# EAGLE design Probe (EAGLE 9.6.2)

## Sheet 1 of 2
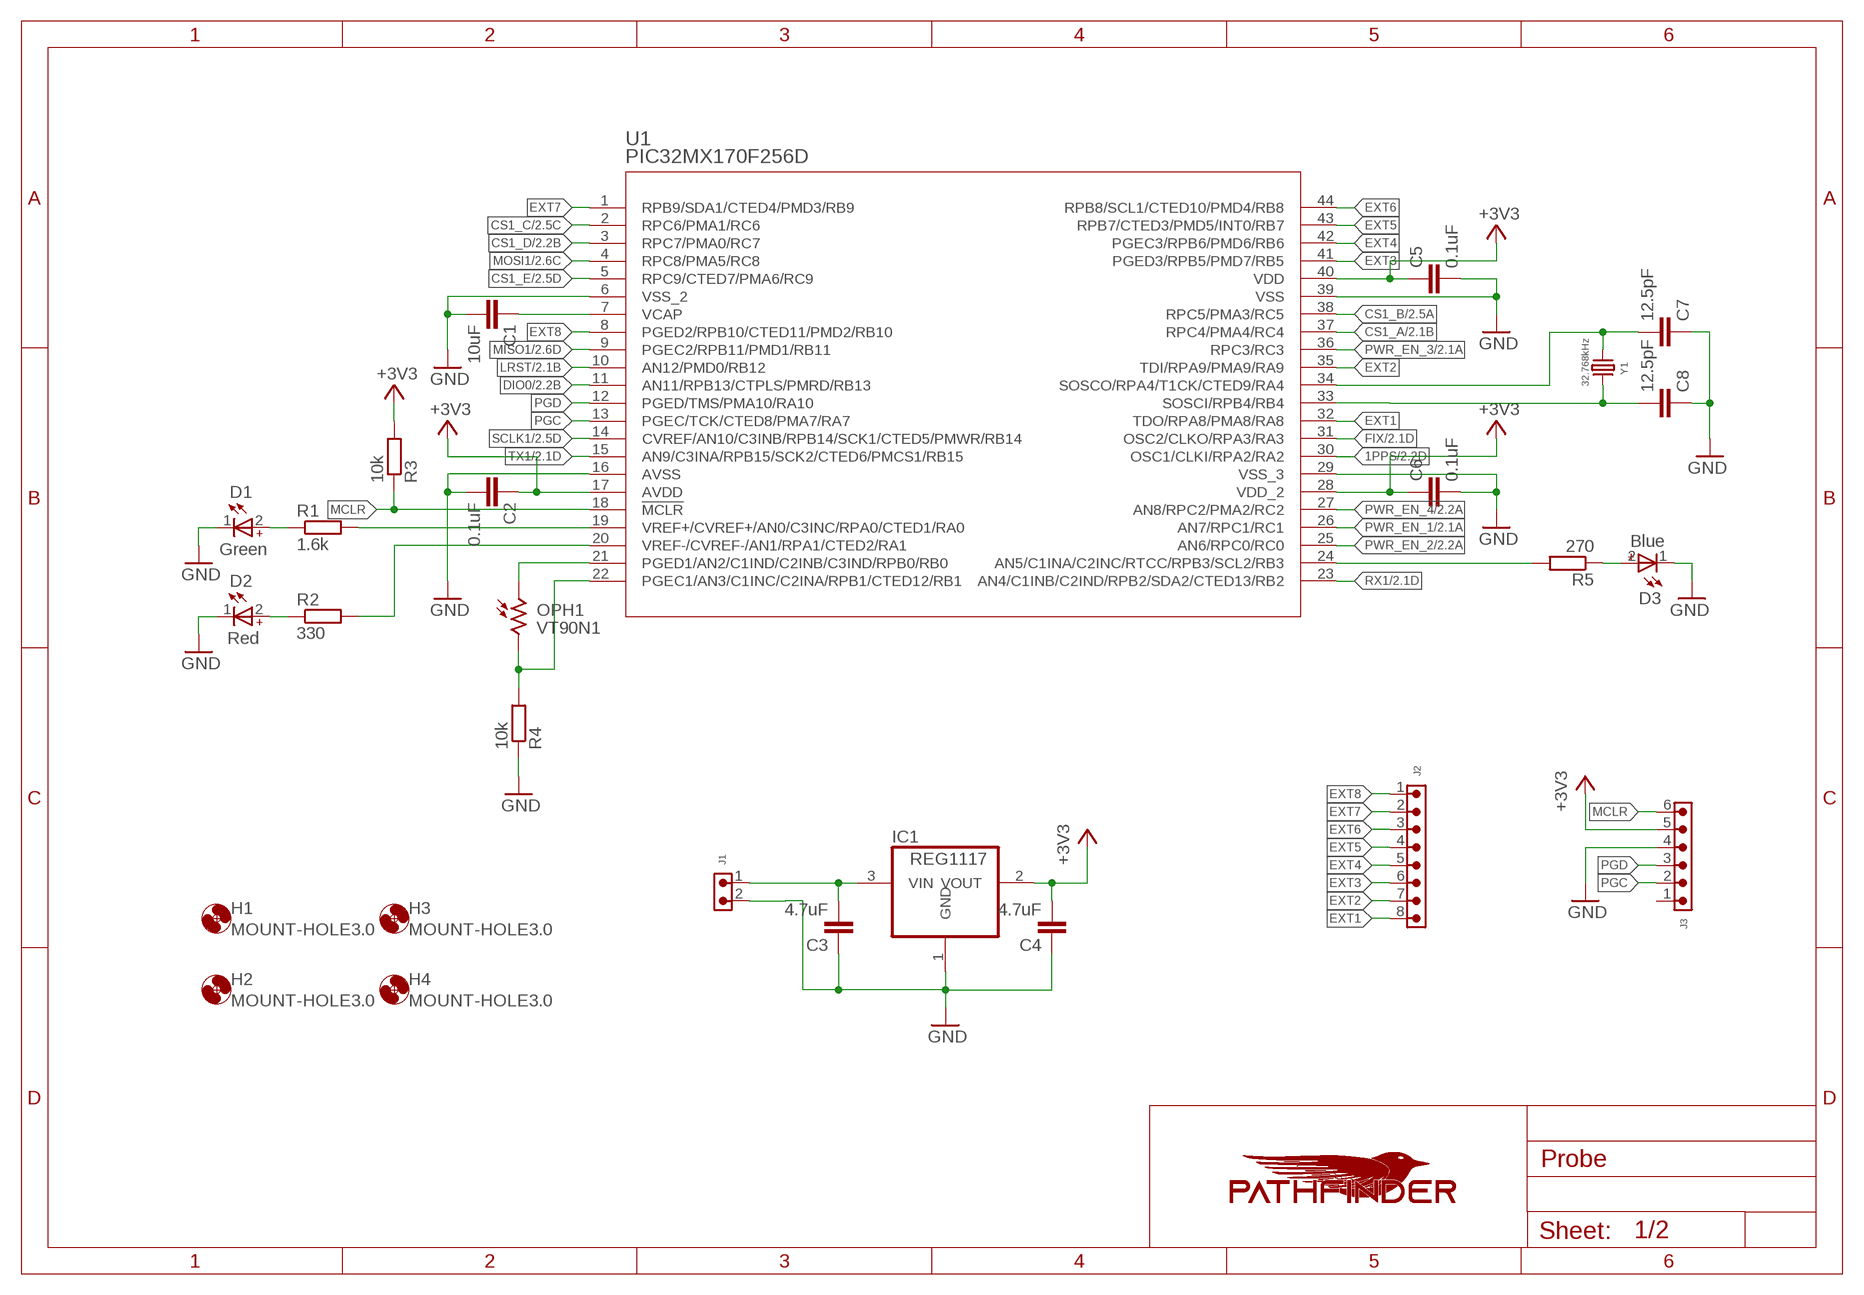
[diagram p0: schematic, sheet 1]

### Parts
C1  10uF  C-EUC0603  [C0603]
C2  0.1uF  C-EUC0402  [C0402]
C3  4.7uF  C-EUC0805  [C0805]
C4  4.7uF  C-EUC0805  [C0805]
C5  0.1uF  C-EUC0402  [C0402]
C6  0.1uF  C-EUC0402  [C0402]
C7  12.5pF  C-EUC0201  [C0201]
C8  12.5pF  C-EUC0201  [C0201]
D1  Green  WL-SMCD_0603_150060GS55040  [WL-SMCD_0603]
D2  Red  WL-SMCD_0603_150060RS55040  [WL-SMCD_0603]
D3  Blue  WL-SMCD_0603_150060BS55040  [WL-SMCD_0603]
H1  MOUNT-HOLE3.0  [3,0]
H2  MOUNT-HOLE3.0  [3,0]
H3  MOUNT-HOLE3.0  [3,0]
H4  MOUNT-HOLE3.0  [3,0]
IC1  REG1117  [SOT223]
J1  6130XX11021_61300211021  [61300211021]
J2  6130XX11021_61300811021  [61300811021]
J3  6130XX11021_61300611021  [61300611021]
OPH1  VT90N1  [VT900]
R1  1.6k  R-EU_R0402  [R0402]
R2  330  R-EU_R0402  [R0402]
R3  10k  R-EU_R0402  [R0402]
R4  10k  R-EU_R0402  [R0402]
R5  270  R-EU_R0402  [R0402]
U1  PIC32MX170F256D  PIC32MX150F128D-  [TQFP44_10X10MC]
U$1  PATHFINDER_LOGO24MM_6MIL_S  [PATHFINDER_LOGO_24MM_6MIL_SERIGRAPHY]
Y1  32.768kHz  WE-XTAL_CFPX-217_830009678  [WE-XTAL_CFPX-217]

### Nets
1PPS: U1.30(OSC1/CLKI/RPA2/RA2) ; also sheet 2
+3V3: C2.1 C4.2 C5.1 C6.1 IC1.2(VOUT) J3.5 R3.2 U1.17(AVDD) U1.28(VDD_2) U1.40(VDD) ; also sheet 2
CS1_A: U1.37(RPC4/PMA4/RC4) ; also sheet 2
CS1_B: U1.38(RPC5/PMA3/RC5) ; also sheet 2
CS1_C: U1.2(RPC6/PMA1/RC6) ; also sheet 2
CS1_D: U1.3(RPC7/PMA0/RC7) ; also sheet 2
CS1_E: U1.5(RPC9/CTED7/PMA6/RC9) ; also sheet 2
DIO0: U1.11(AN11/RPB13/CTPLS/PMRD/RB13) ; also sheet 2
EXT1: J2.8 U1.32(TDO/RPA8/PMA8/RA8)
EXT2: J2.7 U1.35(TDI/RPA9/PMA9/RA9)
EXT3: J2.6 U1.41(PGED3/RPB5/PMD7/RB5)
EXT4: J2.5 U1.42(PGEC3/RPB6/PMD6/RB6)
EXT5: J2.4 U1.43(RPB7/CTED3/PMD5/INT0/RB7)
EXT6: J2.3 U1.44(RPB8/SCL1/CTED10/PMD4/RB8)
EXT7: J2.2 U1.1(RPB9/SDA1/CTED4/PMD3/RB9)
EXT8: J2.1 U1.8(PGED2/RPB10/CTED11/PMD2/RB10)
FIX: U1.31(OSC2/CLKO/RPA3/RA3) ; also sheet 2
GND: C1.2 C2.2 C3.1 C4.1 C5.2 C6.2 C7.1 C8.1 D1.1(_) D2.1(_) D3.1(_) IC1.1(GND) J1.2 J3.4 R4.1 U1.6(VSS_2) U1.16(AVSS) U1.29(VSS_3) U1.39(VSS) ; also sheet 2
LRST: U1.10(AN12/PMD0/RB12) ; also sheet 2
MCLR: J3.6 R3.1 U1.18(!MCLR)
MISO1: U1.9(PGEC2/RPB11/PMD1/RB11) ; also sheet 2
MOSI1: U1.4(RPC8/PMA5/RC8) ; also sheet 2
N$1: C1.1 U1.7(VCAP)
N$5: C7.2 U1.34(SOSCO/RPA4/T1CK/CTED9/RA4) Y1.2
N$6: C8.2 U1.33(SOSCI/RPB4/RB4) Y1.1
N$7: D1.2(+) R1.1
N$8: D2.2(+) R2.1
N$10: OPH1.1 U1.21(PGED1/AN2/C1IND/C2INB/C3IND/RPB0/RB0)
N$11: R1.2 U1.19(VREF+/CVREF+/AN0/C3INC/RPA0/CTED1/RA0)
N$12: R2.2 U1.20(VREF-/CVREF-/AN1/RPA1/CTED2/RA1)
N$13: OPH1.2 R4.2 U1.22(PGEC1/AN3/C1INC/C2INA/RPB1/CTED12/RB1)
N$14: C3.2 IC1.3(VIN) J1.1
N$23: R5.2 U1.24(AN5/C1INA/C2INC/RTCC/RPB3/SCL2/RB3)
N$24: D3.2(+) R5.1
PGC: J3.2 U1.13(PGEC/TCK/CTED8/PMA7/RA7)
PGD: J3.3 U1.12(PGED/TMS/PMA10/RA10)
PWR_EN_1: U1.26(AN7/RPC1/RC1) ; also sheet 2
PWR_EN_2: U1.25(AN6/RPC0/RC0) ; also sheet 2
PWR_EN_3: U1.36(RPC3/RC3) ; also sheet 2
PWR_EN_4: U1.27(AN8/RPC2/PMA2/RC2) ; also sheet 2
RX1: U1.23(AN4/C1INB/C2IND/RPB2/SDA2/CTED13/RB2) ; also sheet 2
SCLK1: U1.14(CVREF/AN10/C3INB/RPB14/SCK1/CTED5/PMWR/RB14) ; also sheet 2
TX1: U1.15(AN9/C3INA/RPB15/SCK2/CTED6/PMCS1/RB15) ; also sheet 2
Unconnected: J3.1

## Sheet 2 of 2
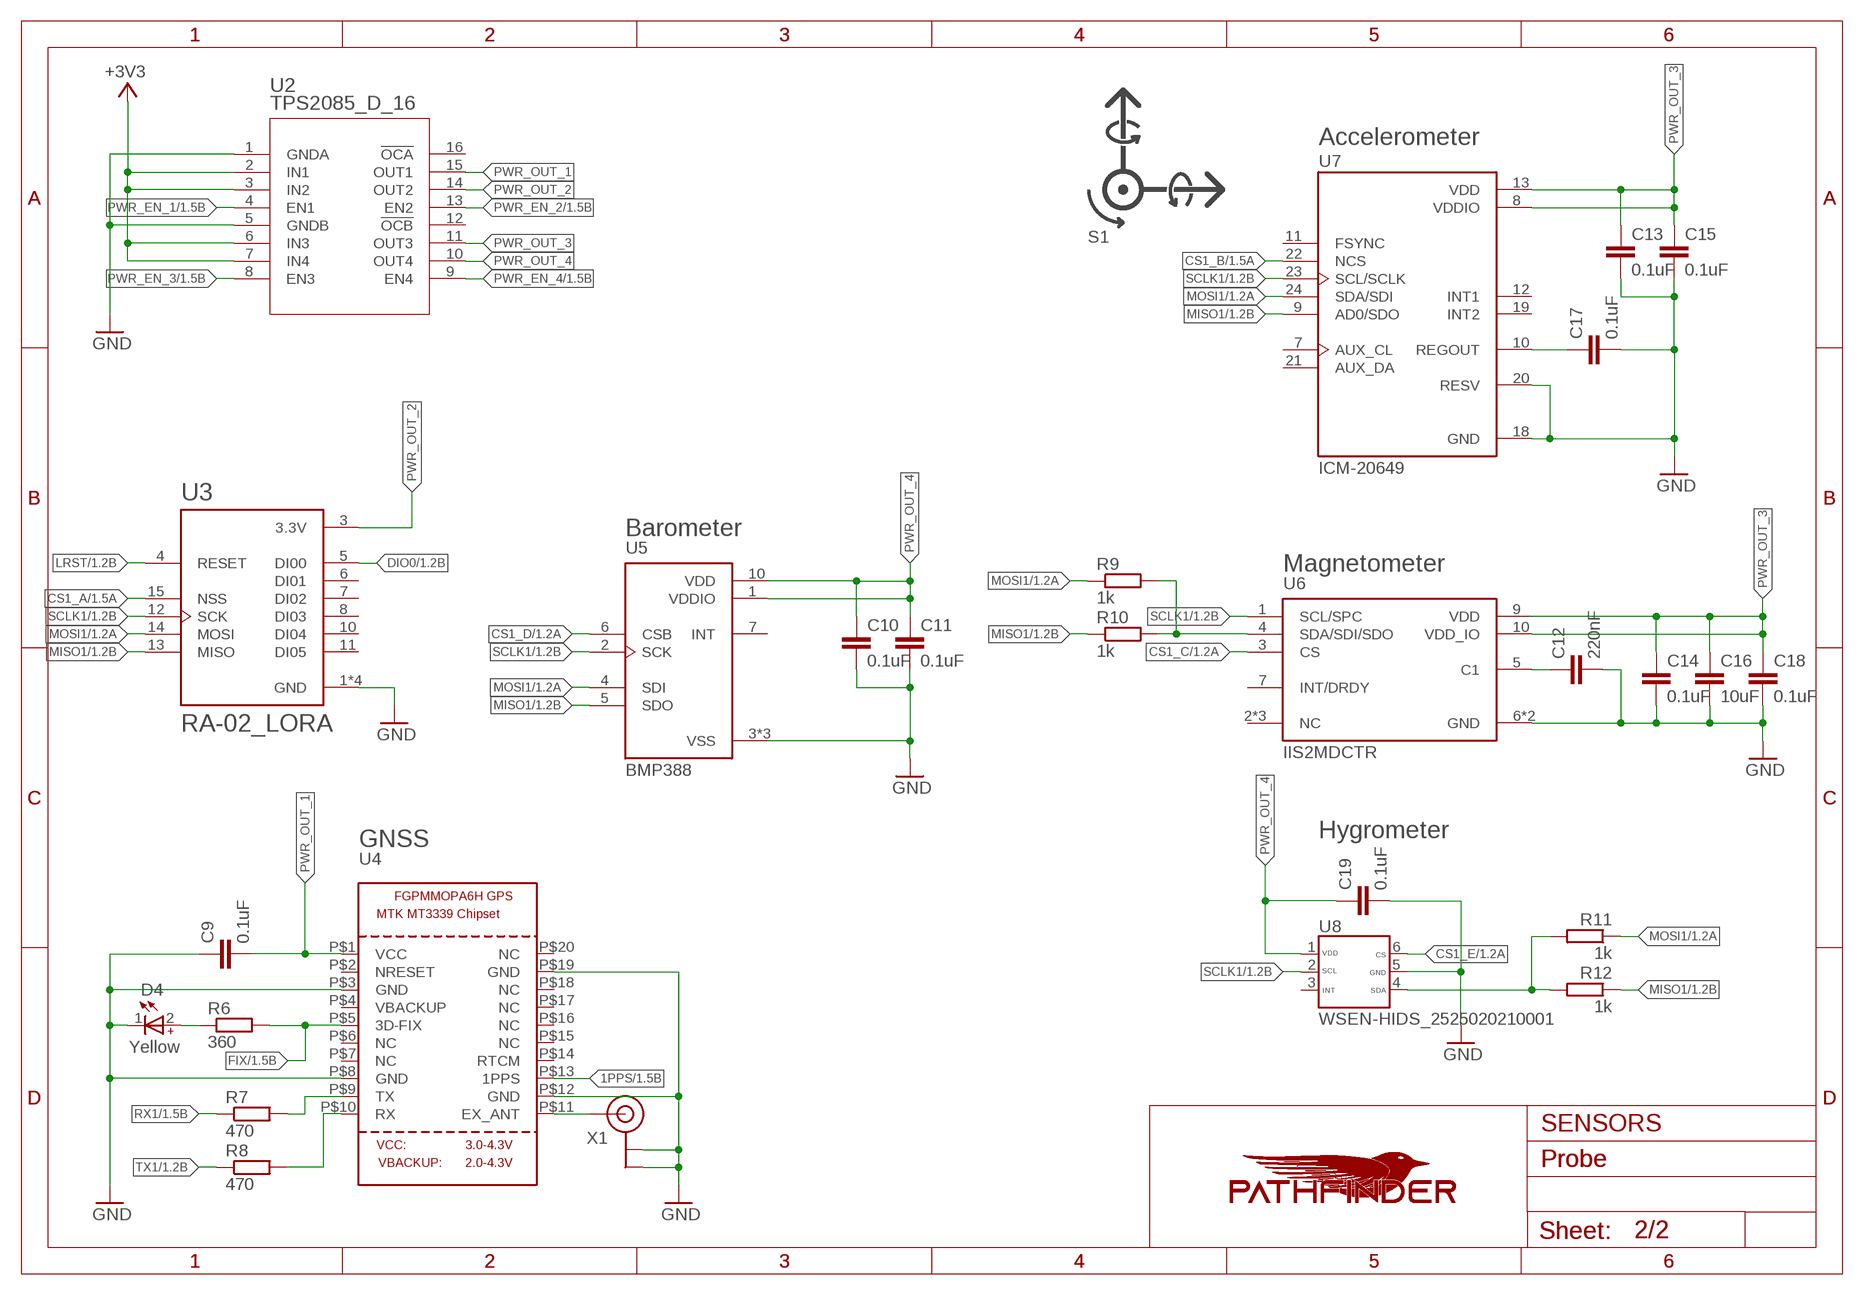
[diagram p1: schematic, sheet 2]

### Parts
C9  0.1uF  C-EUC0402  [C0402]
C10  0.1uF  C-EUC0402  [C0402]
C11  0.1uF  C-EUC0402  [C0402]
C12  220nF  C-EUC0402  [C0402]
C13  0.1uF  C-EUC0402  [C0402]
C14  0.1uF  C-EUC0402  [C0402]
C15  0.1uF  C-EUC0402  [C0402]
C16  10uF  C-EUC0603  [C0603]
C17  0.1uF  C-EUC0402  [C0402]
C18  0.1uF  C-EUC0402  [C0402]
C19  0.1uF  C-EUC0402  [C0402]
D4  Yellow  WL-SMCD_0603_150060YS55040  [WL-SMCD_0603]
R6  360  R-EU_R0402  [R0402]
R7  470  R-EU_R0402  [R0402]
R8  470  R-EU_R0402  [R0402]
R9  1k  R-EU_R0402  [R0402]
R10  1k  R-EU_R0402  [R0402]
R11  1k  R-EU_R0402  [R0402]
R12  1k  R-EU_R0402  [R0402]
S1  COORDINATE_SYSTEM  [DIRECT_AXES]
U2  TPS2085_D_16  [D16]
U3  RA-02_LORA  [MODULE_RA-02_LORA]
U4  GPS_FGPMMOPA6H  [FGPMMOPA6H]
U5  BMP388  [PQFN50P200X200X80-10N]
U6  IIS2MDCTR  [LGA12R50P4X4_200X200X70]
U7  ICM-20649  [QFN40P300X300X95-24N]
U8  WSEN-HIDS_2525020210001  WSEN-HIDS_2525020210001_SIMPLE  [WSEN-HIDS_2525020210001_SIMPLE]
U$2  PATHFINDER_LOGO24MM_6MIL_S  [PATHFINDER_LOGO_24MM_6MIL_SERIGRAPHY]
X1  ANTENNA_U.FL  [U.FL]

### Nets
1PPS: U4.P$13(1PPS) ; also sheet 1
+3V3: U2.2(IN1) U2.3(IN2) U2.6(IN3) U2.7(IN4) ; also sheet 1
CS1_A: U3.15(NSS) ; also sheet 1
CS1_B: U7.22(NCS) ; also sheet 1
CS1_C: U6.3(CS) ; also sheet 1
CS1_D: U5.6(CSB) ; also sheet 1
CS1_E: U8.6(CS) ; also sheet 1
DIO0: U3.5(DI00) ; also sheet 1
FIX: R6.2 U4.P$5(3D-FIX) ; also sheet 1
GND: C9.1 C10.2 C11.2 C12.2 C13.2 C14.2 C15.2 C16.2 C17.2 C18.2 C19.2 D4.1(_) U2.1(GNDA) U2.5(GNDB) U3.1(GND) U3.2(GND) U3.9(GND) U3.16(GND) U4.P$3(GND) U4.P$8(GND) U4.P$12(GND) U4.P$19(GND) U5.3(VSS) U5.8(VSS) U5.9(VSS) U6.6(GND) U6.8(GND) U7.18(GND) U7.20(RESV) U8.5(GND) X1.1(GND) X1.2(GND) ; also sheet 1
LRST: U3.4(RESET) ; also sheet 1
MISO1: R10.1 R12.1 U3.13(MISO) U5.5(SDO) U7.9(AD0/SDO) ; also sheet 1
MOSI1: R9.1 R11.1 U3.14(MOSI) U5.4(SDI) U7.24(SDA/SDI) ; also sheet 1
N$2: C17.1 U7.10(REGOUT)
N$4: D4.2(+) R6.1
N$25: U4.P$11(EX_ANT) X1.3(SIGNAL)
N$29: R7.2 U4.P$9(TX)
N$35: R8.2 U4.P$10(RX)
N$38: R9.2 R10.2 U6.4(SDA/SDI/SDO)
N$39: C12.1 U6.5(C1)
N$43: R11.2 R12.2 U8.4(SDA)
PWR_EN_1: U2.4(EN1) ; also sheet 1
PWR_EN_2: U2.13(EN2) ; also sheet 1
PWR_EN_3: U2.8(EN3) ; also sheet 1
PWR_EN_4: U2.9(EN4) ; also sheet 1
PWR_OUT_1: C9.2 U2.15(OUT1) U4.P$1(VCC)
PWR_OUT_2: U2.14(OUT2) U3.3(3.3V)
PWR_OUT_3: C13.1 C14.1 C15.1 C16.1 C18.1 U2.11(OUT3) U6.9(VDD) U6.10(VDD_IO) U7.8(VDDIO) U7.13(VDD)
PWR_OUT_4: C10.1 C11.1 C19.1 U2.10(OUT4) U5.1(VDDIO) U5.10(VDD) U8.1(VDD)
RX1: R7.1 ; also sheet 1
SCLK1: U3.12(SCK) U5.2(SCK) U6.1(SCL/SPC) U7.23(SCL/SCLK) U8.2(SCL) ; also sheet 1
TX1: R8.1 ; also sheet 1
Unconnected: U2.12(!OCB) U2.16(!OCA) U3.6(DI01) U3.7(DI02) U3.8(DI03) U3.10(DI04) U3.11(DI05) U4.P$2(NRESET) U4.P$4(VBACKUP) U4.P$6(NC) U4.P$7(NC) U4.P$14(RTCM) U4.P$15(NC) U4.P$16(NC) U4.P$17(NC) U4.P$18(NC) U4.P$20(NC) U5.7(INT) U6.2(NC) U6.7(INT/DRDY) U6.11(NC) U6.12(NC) U7.7(AUX_CL) U7.11(FSYNC) U7.12(INT1) U7.19(INT2) U7.21(AUX_DA) U8.3(INT)

### Notes on the sheet
- Accelerometer
- Barometer
- Magnetometer
- Hygrometer
- GNSS
- SENSORS

## Library data of the parts
C1-C19 = rcl:C-EU: CAPACITOR, European symbol; SPICEPREFIX: C
D1 = Wurth_LEDs_WL-SMCD:WL-SMCD_0603: WL-SMCD SMT Mono-color Chip LED Diffused Characteristics Industrial 0603 platform – 1.6 x 0.8 mm Wide viewing angle 140° Thin version: 0.4 mm Applications Office Automation Home appliances Industrial equipment Front panel backlighting Button backlighting LCD backlighting Navigation backlighting <https://www.we-online.com/catalog/media/o121399v209%20Family_WL-SMCD_0603_thin_0,4mm_150060xx55040.jpg> Details see: https://www.we-online.com/catalog/en/WL-SMCD/ Updated By Yingchun Shan 2020-03-18 2020 (C) Wurth Elektronik; ABSTRAHLWINKEL: 140°; CHIP-TECHNOLOGY: InGaN; DATASHEET-URL: https://www.we-online.com/catalog/datasheet/150060GS55040.pdf; EMITTING-COLOR: Green; I-V-TYP: 430mcd; LAMDA-DOM-TYP: 525nm; LAMDA-PEAK-TYP: 520nm; PART-NUMBER: 150060GS55040; V-F-TYP: 3.2V
D2 = Wurth_LEDs_WL-SMCD:WL-SMCD_0603: WL-SMCD SMT Mono-color Chip LED Diffused Characteristics Industrial 0603 platform – 1.6 x 0.8 mm Wide viewing angle 140° Thin version: 0.4 mm Applications Office Automation Home appliances Industrial equipment Front panel backlighting Button backlighting LCD backlighting Navigation backlighting <https://www.we-online.com/catalog/media/o121399v209%20Family_WL-SMCD_0603_thin_0,4mm_150060xx55040.jpg> Details see: https://www.we-online.com/catalog/en/WL-SMCD/ Updated By Yingchun Shan 2020-03-18 2020 (C) Wurth Elektronik; ABSTRAHLWINKEL: 140°; CHIP-TECHNOLOGY: AlInGaP; DATASHEET-URL: https://www.we-online.com/catalog/datasheet/150060RS55040.pdf; EMITTING-COLOR: Red; I-V-TYP: 90mcd; LAMDA-DOM-TYP: 624nm; LAMDA-PEAK-TYP: 632nm; PART-NUMBER: 150060RS55040; V-F-TYP: 2V
D3 = Wurth_LEDs_WL-SMCD:WL-SMCD_0603: WL-SMCD SMT Mono-color Chip LED Diffused Characteristics Industrial 0603 platform – 1.6 x 0.8 mm Wide viewing angle 140° Thin version: 0.4 mm Applications Office Automation Home appliances Industrial equipment Front panel backlighting Button backlighting LCD backlighting Navigation backlighting <https://www.we-online.com/catalog/media/o121399v209%20Family_WL-SMCD_0603_thin_0,4mm_150060xx55040.jpg> Details see: https://www.we-online.com/catalog/en/WL-SMCD/ Updated By Yingchun Shan 2020-03-18 2020 (C) Wurth Elektronik; ABSTRAHLWINKEL: 140°; CHIP-TECHNOLOGY: InGaN; DATASHEET-URL: https://www.we-online.com/catalog/datasheet/150060BS55040.pdf; EMITTING-COLOR: Blue; I-V-TYP: 80mcd; LAMDA-DOM-TYP: 470nm; LAMDA-PEAK-TYP: 465nm; PART-NUMBER: 150060BS55040; V-F-TYP: 3.2V
D4 = Wurth_LEDs_WL-SMCD:WL-SMCD_0603: WL-SMCD SMT Mono-color Chip LED Diffused Characteristics Industrial 0603 platform – 1.6 x 0.8 mm Wide viewing angle 140° Thin version: 0.4 mm Applications Office Automation Home appliances Industrial equipment Front panel backlighting Button backlighting LCD backlighting Navigation backlighting <https://www.we-online.com/catalog/media/o121399v209%20Family_WL-SMCD_0603_thin_0,4mm_150060xx55040.jpg> Details see: https://www.we-online.com/catalog/en/WL-SMCD/ Updated By Yingchun Shan 2020-03-18 2020 (C) Wurth Elektronik; ABSTRAHLWINKEL: 140°; CHIP-TECHNOLOGY: AlInGaP; DATASHEET-URL: https://www.we-online.com/catalog/datasheet/150060YS55040.pdf; EMITTING-COLOR: Yellow; I-V-TYP: 100mcd; LAMDA-DOM-TYP: 589nm; LAMDA-PEAK-TYP: 591nm; PART-NUMBER: 150060YS55040; V-F-TYP: 2V
H1-H4 = holes:MOUNT-HOLE: MOUNTING HOLE with drill center marker
IC1 = burr-brown:REG1117: 800mA and 1A Low Dropout (LDO) Positive Regulator 1.8V, 2.5V, 2.85V, 3.3V, 5V, and Adj; MPN: REG1117; OC_FARNELL: 1097566; OC_NEWARK: 14P6981
J1 = Wurth_Connectors_WR-PHD:6130XX11021_61300211021: WR-PHD 2.54 mm THT Angled Pin Header ARTICLE PROPERTIES: Pins:2;​ 3;​ 4;​ 5;​ 6;​ 7;​ 8;​ 9;​ 10;​ 12;​ 14;​ 16;​ 18;​ 22;​ 32;​ 34;​ 36;​ 40 KIND PROPERTIES: Pitch：2.54 mm Quality Class:3 as per CECC 75 301-802 Rows：Single Gender：Pin Header Type：Angled MATERIAL PROPERTIES: Insulator Material :PA6T Insulator Flammability Rating:UL94 V-0 Contact Material:Copper Alloy Contact Plating:Gold Contact Type:Stamped GENERAL INFORMATION Operating Temperature:-40 up to +105 °C Compliance:Lead free / RoHS ELECTRICAL PROPERTIES: Rated Current:3 A IR 1:3 A Withstanding Voltage:500 V (AC) Contact Resistance:20 mΩ RISO:1000 MΩ CERTIFICATION UL Approval:E323964 PACKAGING PROPERTIES Packaging:Bag <https://katalog.we-online.com/media/images/v2/o33210v209%20Family_WR-PHD_6130xx11021.jpg> Details see: https://katalog.we-online.com/en/em/PHD_2_54_THT_ANGLED_PIN_HEADER_6130XX11021 Updated by Yingchun,Shan 2019-10-16 2019 (C) Würth Elektronik; DATASHEET-URL: https://katalog.we-online.com/em/datasheet/61300211021.pdf; GENDER: Pin Header; IR: 3A; MATES: WR-PHD 2.5mm Angled Socket Header/SMT Socket Header/Socket Header/Soket Header Bottom Entry; PACKAGING: Bag; PART-NUMBER: 61300211021; PINS: 2; ROWS: Single; TYPE: Angled
J2 = Wurth_Connectors_WR-PHD:6130XX11021_61300811021: WR-PHD 2.54 mm THT Angled Pin Header ARTICLE PROPERTIES: Pins:2;​ 3;​ 4;​ 5;​ 6;​ 7;​ 8;​ 9;​ 10;​ 12;​ 14;​ 16;​ 18;​ 22;​ 32;​ 34;​ 36;​ 40 KIND PROPERTIES: Pitch：2.54 mm Quality Class:3 as per CECC 75 301-802 Rows：Single Gender：Pin Header Type：Angled MATERIAL PROPERTIES: Insulator Material :PA6T Insulator Flammability Rating:UL94 V-0 Contact Material:Copper Alloy Contact Plating:Gold Contact Type:Stamped GENERAL INFORMATION Operating Temperature:-40 up to +105 °C Compliance:Lead free / RoHS ELECTRICAL PROPERTIES: Rated Current:3 A IR 1:3 A Withstanding Voltage:500 V (AC) Contact Resistance:20 mΩ RISO:1000 MΩ CERTIFICATION UL Approval:E323964 PACKAGING PROPERTIES Packaging:Bag <https://katalog.we-online.com/media/images/v2/o33210v209%20Family_WR-PHD_6130xx11021.jpg> Details see: https://katalog.we-online.com/en/em/PHD_2_54_THT_ANGLED_PIN_HEADER_6130XX11021 Updated by Yingchun,Shan 2019-10-16 2019 (C) Würth Elektronik; DATASHEET-URL: https://katalog.we-online.com/em/datasheet/61300811021.pdf; GENDER: Pin Header; IR: 3A; MATES: WR-PHD 2.5mm Angled Socket Header/SMT Socket Header/Socket Header/Soket Header Bottom Entry; PACKAGING: Bag; PART-NUMBER: 61300811021; PINS: 8; ROWS: Single; TYPE: Angled
J3 = Wurth_Connectors_WR-PHD:6130XX11021_61300611021: WR-PHD 2.54 mm THT Angled Pin Header ARTICLE PROPERTIES: Pins:2;​ 3;​ 4;​ 5;​ 6;​ 7;​ 8;​ 9;​ 10;​ 12;​ 14;​ 16;​ 18;​ 22;​ 32;​ 34;​ 36;​ 40 KIND PROPERTIES: Pitch：2.54 mm Quality Class:3 as per CECC 75 301-802 Rows：Single Gender：Pin Header Type：Angled MATERIAL PROPERTIES: Insulator Material :PA6T Insulator Flammability Rating:UL94 V-0 Contact Material:Copper Alloy Contact Plating:Gold Contact Type:Stamped GENERAL INFORMATION Operating Temperature:-40 up to +105 °C Compliance:Lead free / RoHS ELECTRICAL PROPERTIES: Rated Current:3 A IR 1:3 A Withstanding Voltage:500 V (AC) Contact Resistance:20 mΩ RISO:1000 MΩ CERTIFICATION UL Approval:E323964 PACKAGING PROPERTIES Packaging:Bag <https://katalog.we-online.com/media/images/v2/o33210v209%20Family_WR-PHD_6130xx11021.jpg> Details see: https://katalog.we-online.com/en/em/PHD_2_54_THT_ANGLED_PIN_HEADER_6130XX11021 Updated by Yingchun,Shan 2019-10-16 2019 (C) Würth Elektronik; DATASHEET-URL: https://katalog.we-online.com/em/datasheet/61300611021.pdf; GENDER: Pin Header; IR: 3A; MATES: WR-PHD 2.5mm Angled Socket Header/SMT Socket Header/Socket Header/Soket Header Bottom Entry; PACKAGING: Bag; PART-NUMBER: 61300611021; PINS: 6; ROWS: Single; TYPE: Angled
OPH1 = photo-elements:VT9: Photoconductive Cell VT900 Series Source: http://optoelectronics.perkinelmer.com/content/Datasheets/DTS_vt900seriesdatasheet.pdf
R1-R12 = rcl:R-EU_: RESISTOR, European symbol; SPICEPREFIX: R
S1 = axes:COORDINATE_SYSTEM
U1 = Microchip:PIC32MX150F128D-
U2 = Texas-Instruments:TPS2085_D_16; MANUFACTURER_PART_NUMBER: tps2085_d_16; VENDOR: Texas Instruments
U3 = RA-02_LORA:RA-02_LORA: Ra-02 LoRa RF M5Stack Platform Evaluation Expansion Board; AVAILABILITY: Unavailable; DESCRIPTION: Ra-02 LoRa RF M5Stack Platform Evaluation Expansion Board; MF: AI-Thinker; MP: Ra-02 LoRa; PACKAGE: Package; PRICE: None
U4 = adafruit:GPS_FGPMMOPA6H: GPS Module - MTK MT3339 Chipset, -165dBm sensitivity, 22 channels, 10Hz, auto-select external antenna options
U5 = Bosh-Sensortec:BMP388: P-Sensor SPI I2C 1, 25 Bar SMD; AVAILABILITY: Unavailable; DESCRIPTION: Pressure Sensor 4.35PSI ~ 18.13PSI (30kPa ~ 125kPa) Absolute 10-WFLGA; MF: Bosch Sensortec; MP: BMP388; PACKAGE: WFLGA-10 Bosch Tools; PRICE: None
U6 = ST-Microelectronics:IIS2MDCTR; MANUFACTURER: ST; PART_NUMBER: IIS2MDCTR
U7 = TDK-Ivensense:ICM-20649: Wide-Range 6-Axis MEMS MotionTracking Device for Sports and High Impact Applications Check prices <https://pricing.snapeda.com/parts/ICM-20649/TDK%20InvenSense/view-part?ref=eda>; AVAILABILITY: Warning; DESCRIPTION: Accelerometer, Gyroscope, Temperature, 6 Axis Sensor I²C, SPI Output; MF: TDK InvenSense; MP: ICM-20649; PACKAGE: QFN-24 TDK; PRICE: None; PURCHASE-URL: https://pricing.snapeda.com/search/part/ICM-20649/?ref=eda
U8 = WE_WSEN-Rev4.1:WSEN-HIDS_2525020210001_SIMPLE: WSEN-HIDS - 2525020210001 Humidity Sensor with integrated Temperature Sensor Details see: https://www.we-online.de/katalog/en/WSEN-HIDS; HEIGHT: 0.9mm; MANUFACTURER: Würth Elektronik; NR: 2525020210001
U$1 U$2 = pathfinder-logo:PATHFINDER_LOGO
X1 = adafruit:ANTENNA_U.FL: U.FL Antenna Connector
Y1 = Eagle_WE-XTAL (rev20b):WE-XTAL_CFPX-217: WE-XTAL Watch Crystals Characteristics SMT and THT models Hermetically sealed Frequency: 32.768 kHz Tolerances down to ±10 ppm available Characteristics Microprocessor Real Time Clocks Test and Measurement Equipment Battery powered Applications <https://www.we-online.com/catalog/media/o162740v209%20Family_WE-XTAL_WatchCrystal.jpg> Details see: https://www.we-online.com/catalog/en/WE-XTAL_WATCHCRYSTAL Updated by Ella Wu, 2020-10-30 2020 (C) Wurth Elektronik; C-LOAD: 12.5pF; DATASHEET-URL: https://www.we-online.com/catalog/datasheet/830009678.pdf; MOUNT: SMT; PART-NUMBER: 830009678; TOLERANCE: ±20ppm

## Board
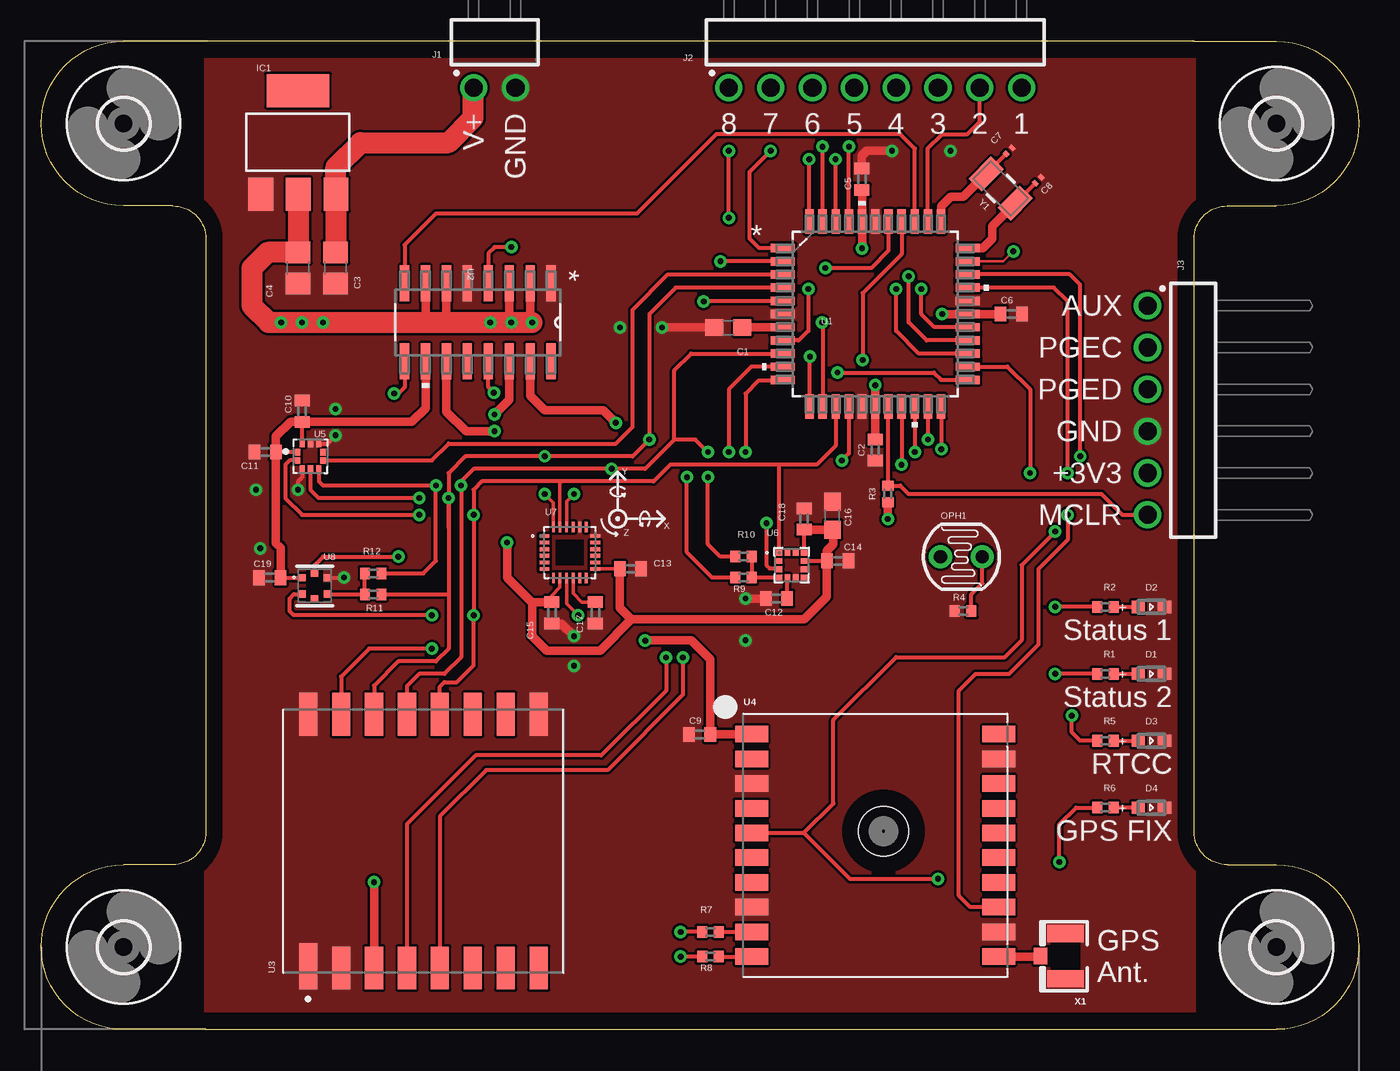
[diagram p2: board, top side]
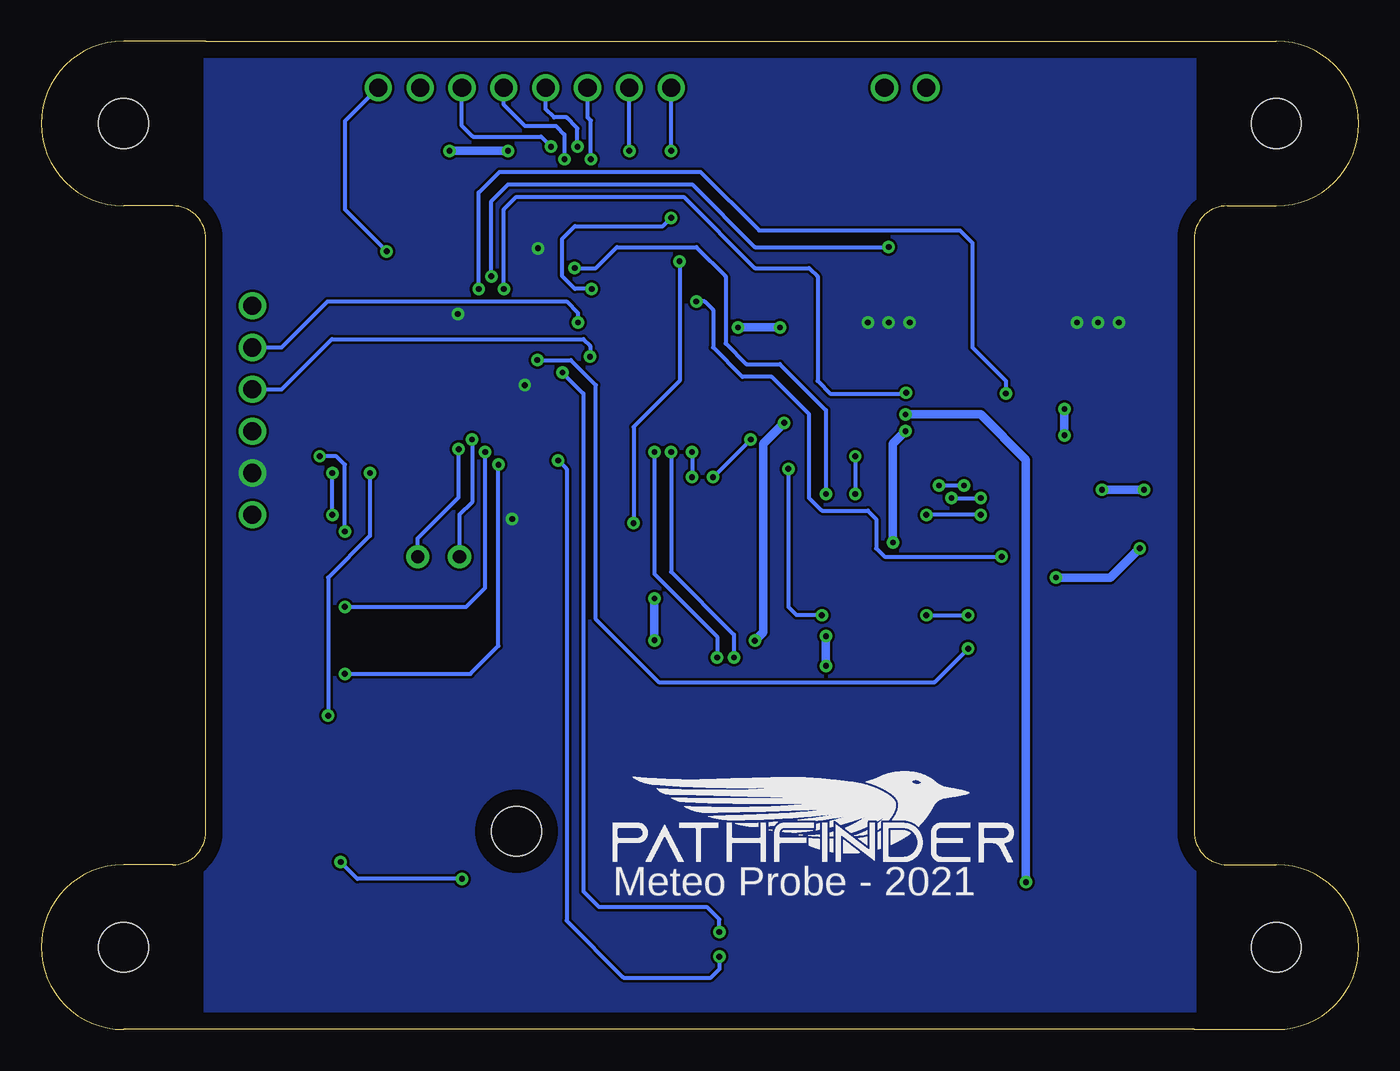
[diagram p3: board, bottom side, seen from below]

Size 80 x 60 mm. Coordinates in mm from the lower left corner, seen from the top.
Outline: 10,0 70,0 75,0 arc180 75,10 72,10 arc-90 70,12 70,48 arc-90 72,50 75,50 arc180 75,60 70,60 10,60 5,60 arc180 5,50 8,50 arc-90 10,48 10,12 arc-90 8,10 5,10 arc180 5,0 10,0
Copper layers (1*16): Top 0.035mm / dielectric 0.2mm / Bottom 0.035mm
Design rules "FirstPCB *": minimum track width 6mil, minimum drill 0.35mm, track to track 6mil, track to pad 6mil, pad to pad 6mil, via to via 6mil, smd to smd 6mil, copper to edge 40mil, drill to drill 6mil, minimum pad ring 10mil, minimum via ring 8mil, stop-mask expansion 2mil, vias tented up to drill 100mil, thermal gap 10mil

### Footprints (pad centres in the part's own frame; a part is rotated, then mirrored left to right if it is on the bottom)
C0603 = smd 1.1 x 1: 1 -0.85,0; 2 0.85,0
C0402 = smd 0.7 x 0.9: 1 -0.65,0; 2 0.65,0
C0805 = smd 1.3 x 1.5: 1 -0.95,0; 2 0.95,0
C0201 = smd 0.25 x 0.35: 1 -0.25,0; 2 0.25,0
WL-SMCD_0603 = smd 0.8 x 0.75: 1 -0.8,0; 2 0.8,0
3,0 = hole 3: 0,0
SOT223 = smd 1.499 x 2.007: 1 -2.261,-3.15; 2 0.025,-3.15; 3 2.311,-3.15 | smd 3.81 x 2.007: 4 0,3.15
61300211021 = drill 1.1: 1 1.27,2.77; 2 -1.27,2.77
61300811021 = drill 1.1: 1 8.89,2.77; 2 6.35,2.77; 3 3.81,2.77; 4 1.27,2.77; 5 -1.27,2.77; 6 -3.81,2.77; 7 -6.35,2.77; 8 -8.89,2.77
61300611021 = drill 1.1: 1 6.35,2.77; 2 3.81,2.77; 3 1.27,2.77; 4 -1.27,2.77; 5 -3.81,2.77; 6 -6.35,2.77
VT900 = drill 0.8 pad 1.4: 1 -1.27,0; 2 1.27,0
R0402 = smd 0.6 x 0.7: 1 -0.5,0; 2 0.5,0
TQFP44_10X10MC = smd 1.473 x 0.508: 1 -5.613,4; 2 -5.613,3.2; 3 -5.613,2.4; 4 -5.613,1.6; 5 -5.613,0.8; 6 -5.613,0; 7 -5.613,-0.8; 8 -5.613,-1.6; 9 -5.613,-2.4; 10 -5.613,-3.2; 11 -5.613,-4; 23 5.613,-4; 24 5.613,-3.2; 25 5.613,-2.4; 26 5.613,-1.6; 27 5.613,-0.8; 28 5.613,0; 29 5.613,0.8; 30 5.613,1.6; 31 5.613,2.4; 32 5.613,3.2; 33 5.613,4 | smd 0.508 x 1.473: 12 -4,-5.613; 13 -3.2,-5.613; 14 -2.4,-5.613; 15 -1.6,-5.613; 16 -0.8,-5.613; 17 0,-5.613; 18 0.8,-5.613; 19 1.6,-5.613; 20 2.4,-5.613; 21 3.2,-5.613; 22 4,-5.613; 34 4,5.613; 35 3.2,5.613; 36 2.4,5.613; 37 1.6,5.613; 38 0.8,5.613; 39 0,5.613; 40 -0.8,5.613; 41 -1.6,5.613; 42 -2.4,5.613; 43 -3.2,5.613; 44 -4,5.613
D16 = smd 2.184 x 0.559: 1 -2.362,4.445; 2 -2.362,3.175; 3 -2.362,1.905; 4 -2.362,0.635; 5 -2.362,-0.635; 6 -2.362,-1.905; 7 -2.362,-3.175; 8 -2.362,-4.445; 9 2.362,-4.445; 10 2.362,-3.175; 11 2.362,-1.905; 12 2.362,-0.635; 13 2.362,0.635; 14 2.362,1.905; 15 2.362,3.175; 16 2.362,4.445
MODULE_RA-02_LORA = smd 2.8 x 1.1: 1 -7.6,7 | smd 2.6 x 1.1: 2 -7.7,5; 3 -7.7,3; 4 -7.7,1; 5 -7.7,-1; 6 -7.7,-3; 7 -7.7,-5; 8 -7.7,-7; 9 7.7,-7; 10 7.7,-5; 11 7.7,-3; 12 7.7,-1; 13 7.7,1; 14 7.7,3; 15 7.7,5; 16 7.7,7
FGPMMOPA6H = smd 2 x 1: P$1 -7.5,6.75; P$2 -7.5,5.25; P$3 -7.5,3.75; P$4 -7.5,2.25; P$5 -7.5,0.75; P$6 -7.5,-0.75; P$7 -7.5,-2.25; P$8 -7.5,-3.75; P$9 -7.5,-5.25; P$10 -7.5,-6.75; P$11 7.5,-6.75; P$12 7.5,-5.25; P$13 7.5,-3.75; P$14 7.5,-2.25; P$15 7.5,-0.75; P$16 7.5,0.75; P$17 7.5,2.25; P$18 7.5,3.75; P$19 7.5,5.25; P$20 7.5,6.75 | hole 3: 0.5,0.85
PQFN50P200X200X80-10N = smd 0.35 x 0.38: 1 -0.765,0.25; 2 -0.765,-0.25; 3 -0.5,-0.765; 4 0,-0.765; 5 0.5,-0.765; 6 0.765,-0.25; 7 0.765,0.25; 8 0.5,0.765; 9 0,0.765; 10 -0.5,0.765
LGA12R50P4X4_200X200X70 = smd 0.4 x 0.35: 1 -0.76,0.75; 2 -0.76,0.25; 3 -0.76,-0.25; 4 -0.76,-0.75; 7 0.76,-0.75; 8 0.76,-0.25; 9 0.76,0.25; 10 0.76,0.75 | smd 0.35 x 0.4: 5 -0.25,-0.76; 6 0.25,-0.76; 11 0.25,0.76; 12 -0.25,0.76
QFN40P300X300X95-24N = smd 0.64 x 0.22: 1 -1.545,1; 2 -1.545,0.6; 3 -1.545,0.2; 4 -1.545,-0.2; 5 -1.545,-0.6; 6 -1.545,-1; 13 1.545,-1; 14 1.545,-0.6; 15 1.545,-0.2; 16 1.545,0.2; 17 1.545,0.6; 18 1.545,1 | smd 0.22 x 0.64: 7 -1,-1.545; 8 -0.6,-1.545; 9 -0.2,-1.545; 10 0.2,-1.545; 11 0.6,-1.545; 12 1,-1.545; 19 1,1.545; 20 0.6,1.545; 21 0.2,1.545; 22 -0.2,1.545; 23 -0.6,1.545; 24 -1,1.545
WSEN-HIDS_2525020210001_SIMPLE = smd 0.4 x 0.45: 1 -0.75,0.5; 2 -0.75,-0.5; 4 0.75,-0.5; 5 0.75,0.5 | smd 0.45 x 0.4: 3 0,-0.75; 6 0,0.75
U.FL = smd 2.2 x 1.05: 1 0,1.375; 2 0,-1.375 | smd 0.8 x 1: 3 1.525,0
WE-XTAL_CFPX-217 = smd 1.1 x 1.9: 1 -1.25,0; 2 1.25,0

### Placement (x,y rotation side)
C1  41.72,42.62 180 top
C2  50.64,35.18 270 top
C3  17.87,46.23 90 top
C4  15.59,46.23 90 top
C5  49.83,51.61 90 top
C6  58.9,43.43 0 top
C7  58.77,53.34 225 top
C8  60.55,51.56 225 top
C9  39.97,17.91 0 top
C10  15.84,37.54 90 top
C11  13.61,35.05 180 top
C12  44.65,26.16 180 top
C13  35.78,27.97 0 top
C14  48.35,28.45 0 top
C15  31,25.29 270 top
C16  48.05,31.19 90 top
C17  33.65,25.3 270 top
C18  46.32,30.99 90 top
C19  13.89,27.43 180 top
D1  67.4,21.59 180 top
D2  67.4,25.65 180 top
D3  67.4,17.53 180 top
D4  67.4,13.46 180 top
H1  5,5 0 top
H2  75,5 0 top
H3  5,55 0 top
H4  75,55 0 top
IC1  15.59,53.85 0 top
J1  27.53,59.94 180 top
J2  50.64,59.94 180 top
J3  69.94,37.59 90 top
OPH1  55.87,28.7 0 top
R1  64.61,21.59 180 top
R2  64.61,25.65 180 top
R3  51.4,32.51 270 top
R4  55.97,25.4 0 top
R5  64.61,17.53 180 top
R6  64.61,13.46 180 top
R7  40.63,5.92 0 top
R8  40.63,4.42 0 top
R9  42.64,27.43 0 top
R10  42.64,28.7 0 top
R11  20.16,26.42 180 top
R12  20.16,27.69 180 top
S1  35,31 0 top
U1  50.64,43.43 0 top
U2  26.51,42.93 270 top
U3  23.21,11.43 90 top
U4  50.64,11.18 0 top
U5  16.35,34.8 0 top
U6  45.56,28.19 0 top
U7  32.1,28.96 0 top
U8  16.6,26.92 0 top
U$1  45.31,10.16 0 bottom
U$2  -2.19,-11.68 0 top  (outside the outline)
X1  62.2,4.45 180 top
Y1  58.26,51.05 135 top

### Tracks (layer width: path | path; a pad name or v marks a point on that pad's centre or on a via)
1PPS  (via drill 0.35)
  Top 0.254: U4.P$13 56.42,7.43 55.72,8.13 55.72,20.57 56.74,21.59 58.77,21.59 60.55,23.37 60.55,27.94 62.32,29.72 v62.32,31.24 | v62.32,33.78 62.32,44.2 61.49,45.03 U1.30
  Bottom 0.254: v62.32,31.24 v62.32,33.78
+3V3  (via drill 0.35)
  Top 0.254: C5.1
  Top 0.508: U2.2 29.68,43.05 v29.81,42.93 | U2.3 28.41,43.05 v28.54,42.93 | U2.6 24.61,43.05 24.73,42.93 | U2.7 23.34,43.05 23.46,42.93 | v49.84,47.42 U1.40 C5.1 | C6.1 U1.28 v54.7,43.43 | C2.1 U1.17 v50.64,39.12 | R3.2 v51.4,30.99
  Top 1.27: 15.61,47.2 C4.2 | C4.2 13.74,47.18 12.79,46.23 12.79,43.94 13.81,42.93 v14.57,42.93 v15.84,42.93 v17.11,42.93 20.67,42.93 23.46,42.93 24.73,42.93 v27.27,42.93 v28.54,42.93 v29.81,42.93 | IC1.2 15.61,47.2 | 15.61,47.2 C4.2
  pour Bottom (no thermals): 10,60 10,0 70,0 70,60
CS1_A  (via drill 0.35)
  Top 0.254: U1.37 52.24,47.07 49.88,44.7 v49.88,40.64 | 18.13,19.05 U3.15 18.21,21.42 19.91,23.11 v23.72,23.11
  Bottom 0.254: v49.88,40.64 47.85,40.64 46.32,39.12 46.32,24.89 42.51,21.08 25.75,21.08 v23.72,23.11
CS1_B  (via drill 0.35)
  Top 0.203: U7.22 31.9,32.06 v32.35,32.51
  Top 0.254: U1.38 51.44,47.28 50.39,46.23 v47.61,46.23
  Bottom 0.254: v32.35,32.51 32.35,37.59 35.15,40.39 37.18,40.39 38.45,41.66 38.45,45.72 40.23,47.5 45.05,47.5 46.32,46.23 v47.61,46.23
CS1_C  (via drill 0.35)
  Top 0.254: U1.2 v41.24,46.63 | v41.24,46.63 | U6.3 44.75,27.99 44.23,27.99 44.04,28.18 v44.04,30.73
  Bottom 0.254: v41.24,46.63 41.24,39.37 44.04,36.58 v44.04,30.73
CS1_D
  Top 0.254: U1.3 38.05,45.83 35.91,43.69 35.91,36.58 34.89,35.56 24.73,35.56 23.72,34.55 U5.6
CS1_E  (via drill 0.35)
  Top 0.254: U1.5 44.99,44.2 v40.23,44.2 | U8.6 16.6,28.19 17.11,28.7 v21.68,28.7
  Bottom 0.254: v21.68,28.7 28.8,28.7 29.3,29.21 29.3,30.99 29.81,31.5 32.61,31.5 33.37,32.26 33.37,37.34 35.65,39.62 37.43,39.62 39.21,41.4 39.21,43.69 39.72,44.2 v40.23,44.2
DIO0  (via drill 0.35)
  Top 0.254: U1.11 44.96,39.37 43.53,39.37 42.77,38.61 v42.77,35.05 | v38.96,22.58 38.96,20.32 34.38,15.75 27.02,15.75 24.21,12.94 U3.5
  Bottom 0.254: v42.77,35.05 42.77,27.66 38.96,23.85 v38.96,22.58
EXT1  (via drill 0.35)
  Top 0.152: U1.32 58.41,46.63 v59.02,47.24
  Bottom 0.254: v59.02,47.24 61.56,49.78 61.56,55.14 J2.8
EXT2
  Top 0.254: U1.35 53.84,53.49 54.7,54.36 56.23,54.36 56.99,55.12 J2.7
EXT3  (via drill 0.35)
  Top 0.152: v49.04,53.59
  Top 0.254: U1.41 v49.04,53.59
  Bottom 0.254: v49.04,53.59 49.65,54.21 53.79,54.21 54.45,54.86 J2.6
EXT4  (via drill 0.35)
  Top 0.254: U1.42 v48.24,52.82 v48.23,52.83
  Bottom 0.254: J2.5 51.91,56.13 50.64,54.86 48.76,54.86 48.23,54.33 v48.23,52.83
EXT5  (via drill 0.35)
  Top 0.152: v47.44,53.59
  Top 0.254: U1.43 v47.44,53.59
  Bottom 0.254: v47.44,53.59 47.44,54.71 48.1,55.37 48.86,55.37 49.37,55.88 J2.4
EXT6  (via drill 0.35)
  Top 0.152: v46.64,52.82 v46.63,52.83
  Top 0.254: U1.44 v46.64,52.82
  Bottom 0.254: v46.63,52.83 46.63,55.17 46.83,55.37 J2.3
EXT7  (via drill 0.35)
  Top 0.254: U1.1 43.59,47.43 43.02,48.01 43.02,52.07 v44.29,53.34
  Bottom 0.254: v44.29,53.34 J2.2
EXT8  (via drill 0.35)
  Top 0.152: U1.8 45.1,41.91
  Top 0.254: v46.58,44.96 46.58,42.42 45.99,41.83 U1.8 | v41.75,49.28 v41.75,53.34
  Bottom 0.254: v46.58,44.96 47.59,44.96 48.35,45.72 48.35,48.01 47.59,48.77 42.26,48.77 v41.75,49.28 | v41.75,53.34 J2.1
FIX  (via drill 0.35)
  Top 0.254: 43.13,11.94 U4.P$5 46.31,11.93 | v61.56,30.23 59.53,28.19 59.53,23.62 58.51,22.61 51.91,22.61 48.1,18.8 48.1,13.72 46.31,11.93 | v63.09,34.8 63.09,45.21 62.46,45.83 U1.31 | 46.31,11.93 49.09,9.14 v54.45,9.14 | v61.82,10.16 61.82,12.45 62.83,13.46 R6.2
  Bottom 0.254: v61.56,30.23 61.56,34.29 62.07,34.8 v63.09,34.8 | v54.45,9.14 60.8,9.14 v61.82,10.16
GND  (via drill 0.35)
  Top 0.254: U5.3 15.85,33.52 15.59,33.26 v15.59,32.77 | U5.8 17.37,35.56 v17.87,36.07 | U8.5 17.36,27.43 v18.38,27.43
  Top 0.508: C5.2 49.83,53.03 50.13,53.34 v51.66,53.34 | C12.2 v42.77,26.16 | C1.2 v37.69,42.62 | C15.2 31.58,24.64 v32.35,23.88
  Bottom 0.508: v51.66,53.34 v55.21,53.34 | v42.77,26.16 v42.77,23.62 | v37.69,42.62 v35.15,42.62 | v15.59,32.77 v13.05,32.77 | v17.87,36.07 v17.87,37.67 | v32.35,23.88 v32.35,22.07 | v18.38,27.43 15.08,27.43 v13.3,29.21
  pour Top (no thermals): 10,60 10,0 70,0 70,60
LRST  (via drill 0.35)
  Top 0.254: U1.10 43.12,40.23 41.75,38.86 v41.75,35.05 | U3.4 22.21,12.46 26.38,16.64 34,16.64 37.94,20.57 v37.94,22.58
  Bottom 0.254: v37.94,22.58 37.94,23.96 41.75,27.77 v41.75,35.05
MCLR
  Top 0.254: J3.6 65.65,31.24 64.39,32.5 52.67,32.5 52.16,33.01 R3.1 51.44,33.05 U1.18
MISO1  (via drill 0.35)
  Top 0.203: U7.9 31.9,25.85 v32.61,25.15
  Top 0.254: U5.5 | U5.5 | 38.45,35.81 38.45,40.02 39.46,41.03 U1.9 | 38.45,35.81 36.67,34.04 v34.64,34.04 26.26,34.04 25.49,33.27 v25.49,33.02 25.49,22.61 24.48,21.59 22.95,21.59 22.21,20.84 U3.13 | U5.5 | R10.1 41.24,28.7 40.48,29.46 v40.48,33.53 | v40.48,35.05 39.72,35.81 38.45,35.81 | U5.5 | U5.5 16.86,33.27 17.11,33.02 v23.97,33.02 23.97,28.45 23.21,27.69 R12.1
  Bottom 0.254: v40.48,35.05 v40.48,33.53 | v23.97,33.02 v25.49,33.02 | v34.64,34.04 34.64,25.65 34.13,25.15 v32.61,25.15
MOSI1  (via drill 0.35)
  Top 0.203: U7.24 31.1,31.99 v30.57,32.51
  Top 0.254: U1.4 38.52,45.03 36.92,43.43 v36.92,35.81 35.91,34.8 v30.57,34.8 25.75,34.8 24.73,33.78 24.73,30.48 v24.73,32.26 24.73,26.42 | R9.1 40.73,27.43 39.21,28.96 v39.21,33.53 | R11.1 24.73,26.42 | U5.4 16.35,32.77 16.86,32.26 v22.95,32.26 | 24.73,26.42 24.73,23.11 23.97,22.35 21.68,22.35 20.21,20.88 U3.14
  Bottom 0.254: v30.57,34.8 v30.57,32.51 | v39.21,33.53 v36.92,35.81 | v24.73,32.26 v22.95,32.26
N$1
  Top 0.254: C1.1 42.69,42.63
  Top 0.508: U1.7 42.69,42.63 C1.1
N$2
  Top 0.203: U7.10 32.3,26.47 32.82,25.95 C17.1
N$4
  Top 0.254: D4.2 R6.1
N$5
  Top 0.254: C7.2 Y1.2
  Top 0.508: U1.34 54.64,49.97 55.21,50.55 55.98,50.55 Y1.2
N$6
  Top 0.254: C8.2 59.15,50.17 Y1.1
  Top 0.508: U1.33 57.18,47.43 57.75,48.01 57.75,48.78 Y1.1
N$7
  Top 0.254: R1.1 D1.2
N$8
  Top 0.254: R2.1 D2.2
N$10  (via drill 0.35)
  Top 0.254: U1.21 v53.84,35.81
  Bottom 0.254: OPH1.1 54.6,31.24 53.84,32 v53.84,35.81
N$11  (via drill 0.35)
  Top 0.254: U1.19 v52.24,34.29 | R1.2 v61.56,21.59
  Bottom 0.254: v52.24,34.29 52.24,23.29 53.94,21.59 v61.56,21.59
N$12  (via drill 0.35)
  Top 0.254: U1.20 v53.04,35.05 | R2.2 v61.56,25.65
  Bottom 0.254: v53.04,35.05 53.04,26.81 54.2,25.65 v61.56,25.65
N$13  (via drill 0.35)
  Top 0.254: U1.22 54.64,35.24 v54.65,35.23 | OPH1.2 57.14,27.08 56.47,26.41 R4.2
  Bottom 0.254: v54.65,35.23 54.65,32.31 57.14,29.82 OPH1.2
N$14
  Top 1.27: 17.94,47.24 C3.2 17.9,47.2 IC1.3 17.9,52.35 19.4,53.85 24.73,53.85 26.23,55.35 26.23,57.15 J1.1
N$23  (via drill 0.35)
  Top 0.254: U1.24 58.67,40.23 60.04,38.86 v60.04,33.78 | R5.2 63.09,17.53 62.58,18.03 v62.58,19.05
  Bottom 0.254: v60.04,33.78 60.04,29.97 62.58,27.43 v62.58,19.05
N$24
  Top 0.254: R5.1 D3.2
N$25
  Top 0.508: U4.P$11 60.65,4.43 X1.3
N$29
  Top 0.254: R7.2 43.13,5.92 U4.P$9
N$35
  Top 0.254: R8.2 U4.P$10
N$38
  Top 0.254: R9.2 43.15,27.44 | 43.15,27.44 U6.4 | R10.2 43.14,27.46 43.15,27.44
N$39
  Top 0.254: C12.1 U6.5
N$43
  Top 0.254: R12.2 R11.2 U8.4
PGC  (via drill 0.35)
  Top 0.254: v47.41,42.93 47.44,42.9 U1.13
  Bottom 0.254: J3.2 65.4,41.4 62.6,44.2 48.1,44.2 47.41,43.51 v47.41,42.93
PGD  (via drill 0.35)
  Top 0.254: v46.68,40.84 46.64,40.81 U1.12
  Bottom 0.254: v46.68,40.84 46.68,41.5 47.08,41.91 62.35,41.91 65.4,38.86 J3.3
PWR_EN_1  (via drill 0.35)
  Top 0.254: U1.26 53.76,41.83 52.67,42.93 v52.67,45.72 | v28.54,47.5 27.53,47.5 27.14,47.12 U2.4
  Bottom 0.254: v52.67,45.72 52.67,50.29 51.66,51.31 40.48,51.31 36.67,47.5 v28.54,47.5
PWR_EN_2  (via drill 0.35)
  Top 0.254: U1.25 53.29,41.03 51.91,42.42 v51.91,44.96 | v27.48,38.66 27.14,38.99 U2.13
  Bottom 0.254: v51.91,44.96 51.91,49.78 51.15,50.55 40.99,50.55 36.67,46.23 33.37,46.23 32.86,45.72 32.86,39.37 32.1,38.61 27.53,38.61 v27.48,38.66
PWR_EN_3
  Top 0.254: U1.36 53.04,53.48 52.16,54.36 48.1,54.36 40.99,54.36 36.16,49.53 23.97,49.53 22.06,47.62 U2.8
PWR_EN_4  (via drill 0.35)
  Top 0.254: U1.27 54.23,42.63 53.43,43.43 v53.43,44.96 | U2.9 22.06,38.99 21.68,38.61 v21.43,38.61
  Bottom 0.254: v53.43,44.96 53.43,50.8 52.16,52.07 39.97,52.07 36.42,48.51 24.22,48.51 23.46,47.75 23.46,41.4 21.43,39.37 v21.43,38.61
PWR_OUT_1  (via drill 0.35)
  Top 0.508: U2.15 29.68,38.48 30.57,37.59 34.13,37.59 v34.89,36.83 | v36.67,23.6 36.69,23.62 39.46,23.62 40.62,22.46 C9.2 40.64,17.93 U4.P$1
  Bottom 0.508: v34.89,36.83 36.16,35.56 36.16,24.11 v36.67,23.6
PWR_OUT_2  (via drill 0.35)
  Top 0.508: U2.14 28.41,38.23 v27.53,37.34 | v20.21,8.94 U3.3
  Bottom 0.508: v27.53,37.34 22.95,37.34 20.21,34.59 v20.21,8.94
PWR_OUT_3  (via drill 0.35)
  Top 0.203: U7.13 35.12,27.96 C13.1 | 30.99,25.96 C15.1 31,26.34 31.5,26.83 U7.8
  Top 0.254: C16.1 | U6.10 C18.1 | U6.9 C14.1
  Top 0.508: U2.11 24.61,37.52 25.8,36.32 v27.53,36.32 | C18.1 C16.1 48.1,30.29 48.1,29.46 47.7,29.07 C14.1 47.7,26.27 46.32,24.89 35.84,24.89 | 29.78,25.94 C15.1 | v28.29,29.57 28.29,27.43 29.78,25.94 | 29.78,25.94 29.81,25.91 29.81,23.88 30.7,22.99 33.93,22.99 35.84,24.89 | C13.1 35.13,25.6 35.84,24.89
  Bottom 0.508: v27.53,36.32 28.29,35.56 v28.29,29.57
PWR_OUT_4
  Top 0.254: C10.1 U5.10 | U5.1 C11.1 | C19.1 15.85,27.43 U8.1
  Top 0.508: 15.78,36.83 C10.1 15.14,36.89 14.26,36.01 C11.1 14.26,29.52 14.54,29.25 C19.1 | U2.10 23.34,37.72 22.5,36.88 C10.1
RX1  (via drill 0.35)
  Top 0.254: R7.1 v38.83,5.92 | U1.23 54.64,39.43 54.2,39.88 v48.35,39.88
  Bottom 0.254: v38.83,5.92 38.83,6.68 39.59,7.44 46.14,7.44 47.08,8.38 47.08,38.61 v48.35,39.88
SCLK1  (via drill 0.35)
  Top 0.203: U7.23 31.5,33.24 31.46,33.27
  Top 0.254: U1.14 48.24,35.45 47.08,34.29 44.8,34.29 | 44.8,34.29 | 44.8,34.29 38.19,34.29 37.18,33.27 31.59,33.27 31.46,33.27 26.76,33.27 26.26,32.77 v26.26,31.24 v26.26,25.15 26.26,22.1 25.24,21.08 24.48,21.08 24.21,20.81 U3.12 | U6.1 44.8,34.29 | 44.8,34.29 | U5.2 15.08,34.54 14.83,34.29 14.83,32.26 15.84,31.24 v22.95,31.24 | U8.2 15.34,26.42 15.08,26.16 15.08,25.4 15.33,25.15 v23.72,25.15
  Bottom 0.254: v26.26,25.15 v23.72,25.15 | v22.95,31.24 v26.26,31.24
TX1  (via drill 0.35)
  Top 0.254: R8.1 v38.83,4.42 | U1.15 49.04,34.98 v48.61,34.54
  Bottom 0.254: v38.83,4.42 38.83,3.66 39.34,3.15 44.65,3.15 48.1,6.6 48.1,34.04 v48.61,34.54

### Text on the board
tNames: V+ | GND | 8 | 7 | 6 | 5 | 4 | 3 | 2 | 1 | AUX | PGEC | PGED | GND | +3V3 | MCLR | Status 1 | Status 2 | RTCC | GPS FIX | GPS / Ant.
bNames: Meteo Probe - 2021